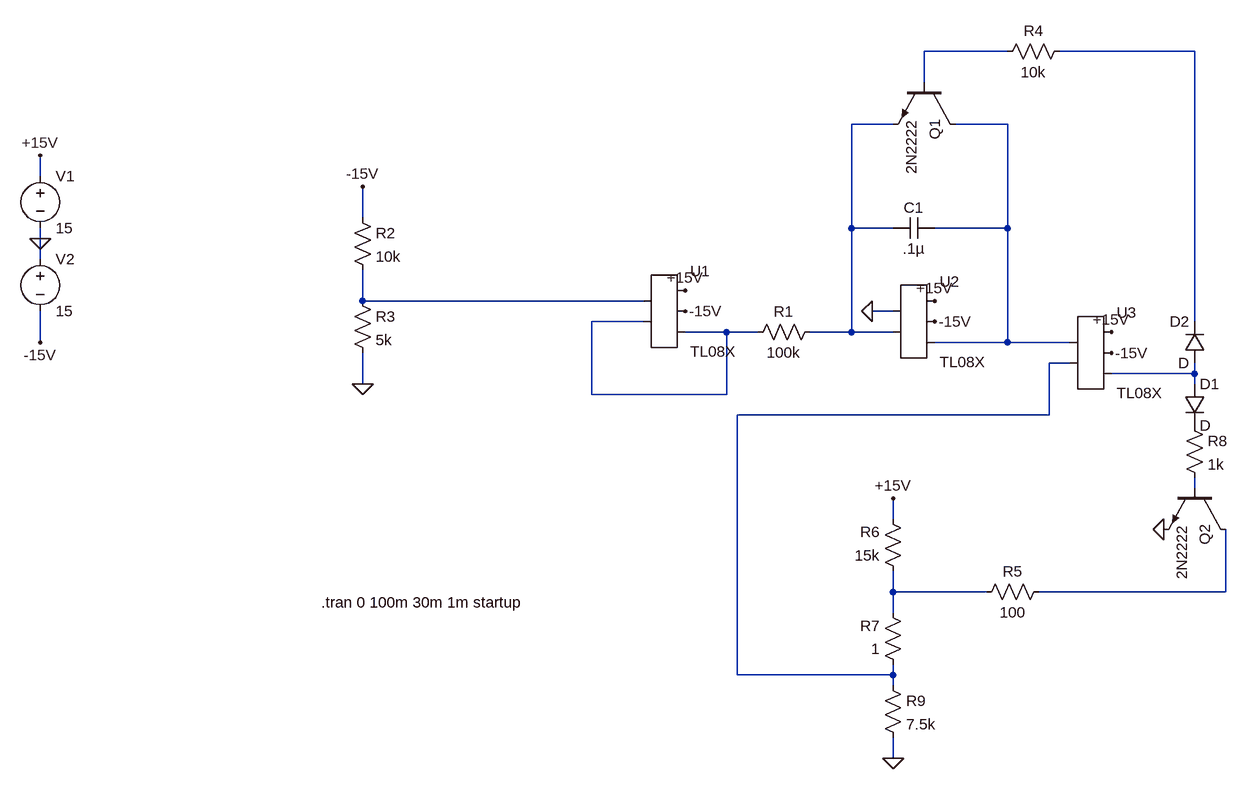
[diagram p0: schematic Ramp_gen_PRO.asc]
Ramp_gen_PRO.asc, the LTspice schematic file:
Version 4
SHEET 1 964 820
WIRE 608 -288 480 -288
WIRE 896 -288 688 -288
WIRE 480 -240 480 -288
WIRE 432 -176 368 -176
WIRE 608 -176 528 -176
WIRE -880 -96 -880 -128
WIRE -384 -32 -384 -80
WIRE 368 -16 368 -176
WIRE 432 -16 368 -16
WIRE 608 -16 608 -176
WIRE 608 -16 496 -16
WIRE -880 0 -880 -16
WIRE -880 32 -880 0
WIRE -384 96 -384 48
WIRE 48 96 -384 96
WIRE 432 112 400 112
WIRE 48 128 -32 128
WIRE 896 128 896 -288
WIRE 176 144 112 144
WIRE 224 144 176 144
WIRE 368 144 368 -16
WIRE 368 144 304 144
WIRE 432 144 368 144
WIRE -880 160 -880 112
WIRE 608 160 608 -16
WIRE 608 160 496 160
WIRE 704 160 608 160
WIRE 704 192 672 192
WIRE 896 208 896 192
WIRE 896 208 768 208
WIRE -384 224 -384 176
WIRE 896 224 896 208
WIRE -32 240 -32 128
WIRE 176 240 176 144
WIRE 176 240 -32 240
WIRE 672 272 672 192
WIRE 672 272 192 272
WIRE 896 384 896 368
WIRE 432 432 432 400
WIRE 432 544 432 512
WIRE 576 544 432 544
WIRE 944 544 944 448
WIRE 944 544 656 544
WIRE 432 576 432 544
WIRE 192 672 192 272
WIRE 432 672 432 656
WIRE 432 672 192 672
WIRE 432 688 432 672
WIRE 432 800 432 768
FLAG 400 112 0
FLAG -880 0 0
FLAG -880 -128 +15V
FLAG -880 160 -15V
FLAG -384 224 0
FLAG -384 -80 -15V
FLAG 112 112 -15V
FLAG 496 128 -15V
FLAG 112 80 +15V
FLAG 496 96 +15V
FLAG 768 144 +15V
FLAG 768 176 -15V
FLAG 848 448 0
FLAG 432 400 +15V
FLAG 432 800 0
SYMBOL AutoGenerated\\TL08X 80 112 R0
SYMATTR InstName U1
SYMBOL AutoGenerated\\TL08X 464 128 R0
SYMATTR InstName U2
SYMBOL cap 496 -32 R90
WINDOW 0 0 32 VBottom 2
WINDOW 3 32 32 VTop 2
SYMATTR InstName C1
SYMATTR Value .1µ
SYMBOL res 320 128 R90
WINDOW 0 0 56 VBottom 2
WINDOW 3 32 56 VTop 2
SYMATTR InstName R1
SYMATTR Value 100k
SYMBOL voltage -880 -112 R0
WINDOW 123 0 0 Left 0
WINDOW 39 0 0 Left 0
SYMATTR InstName V1
SYMATTR Value 15
SYMBOL voltage -880 16 R0
WINDOW 123 0 0 Left 0
WINDOW 39 0 0 Left 0
SYMATTR InstName V2
SYMATTR Value 15
SYMBOL res -400 -48 R0
SYMATTR InstName R2
SYMATTR Value 10k
SYMBOL res -400 80 R0
SYMATTR InstName R3
SYMATTR Value 5k
SYMBOL AutoGenerated\\TL08X 736 176 R0
SYMATTR InstName U3
SYMBOL diode 880 224 R0
SYMATTR InstName D1
SYMBOL diode 912 192 R180
WINDOW 0 24 64 Left 2
WINDOW 3 24 0 Left 2
SYMATTR InstName D2
SYMBOL npn 528 -240 R90
SYMATTR InstName Q1
SYMATTR Value 2N2222
SYMBOL res 704 -304 R90
WINDOW 0 0 56 VBottom 2
WINDOW 3 32 56 VTop 2
SYMATTR InstName R4
SYMATTR Value 10k
SYMBOL npn 944 384 R90
SYMATTR InstName Q2
SYMATTR Value 2N2222
SYMBOL res 672 528 R90
WINDOW 0 0 56 VBottom 2
WINDOW 3 32 56 VTop 2
SYMATTR InstName R5
SYMATTR Value 100
SYMBOL res 448 528 R180
WINDOW 0 36 76 Left 2
WINDOW 3 36 40 Left 2
SYMATTR InstName R6
SYMATTR Value 15k
SYMBOL res 448 672 R180
WINDOW 0 36 76 Left 2
WINDOW 3 36 40 Left 2
SYMATTR InstName R7
SYMATTR Value 1
SYMBOL res 880 272 R0
SYMATTR InstName R8
SYMATTR Value 1k
SYMBOL res 416 672 R0
SYMATTR InstName R9
SYMATTR Value 7.5k
TEXT -448 560 Left 2 !.tran 0 100m 30m 1m startup

The netlist it stands for:
* Ramp_gen_PRO.asc
* U1: TL08X (symbol AutoGenerated\TL08X not available, pins judged from their places): pin1=N005 pin2=N006 pin3=+15V pin4=-15V pin5=N006
* U2: TL08X (symbol AutoGenerated\TL08X not available, pins judged from their places): pin1=0 pin2=N003 pin3=+15V pin4=-15V pin5=N004
C1 N004 N003 .1µ
R1 N003 N006 100k
V1 +15V 0 15
V2 0 -15V 15
R2 -15V N005 10k
R3 N005 0 5k
* U3: TL08X (symbol AutoGenerated\TL08X not available, pins judged from their places): pin1=N004 pin2=N007 pin3=+15V pin4=-15V pin5=N008
D1 N008 P001 D
D2 N008 N002 D
Q1 N004 N001 N003 0 2N2222
R4 N002 N001 10k
Q2 N011 N009 0 0 2N2222
R5 N011 N010 100
R6 N010 +15V 15k
R7 N007 N010 1
R8 P001 N009 1k
R9 N007 0 7.5k
.model D D
.lib standard.dio
.model NPN NPN
.model PNP PNP
.lib standard.bjt
.tran 0 100m 30m 1m startup
.backanno
.end